# Altium schematic sheet frontscript.SchDoc
size A4
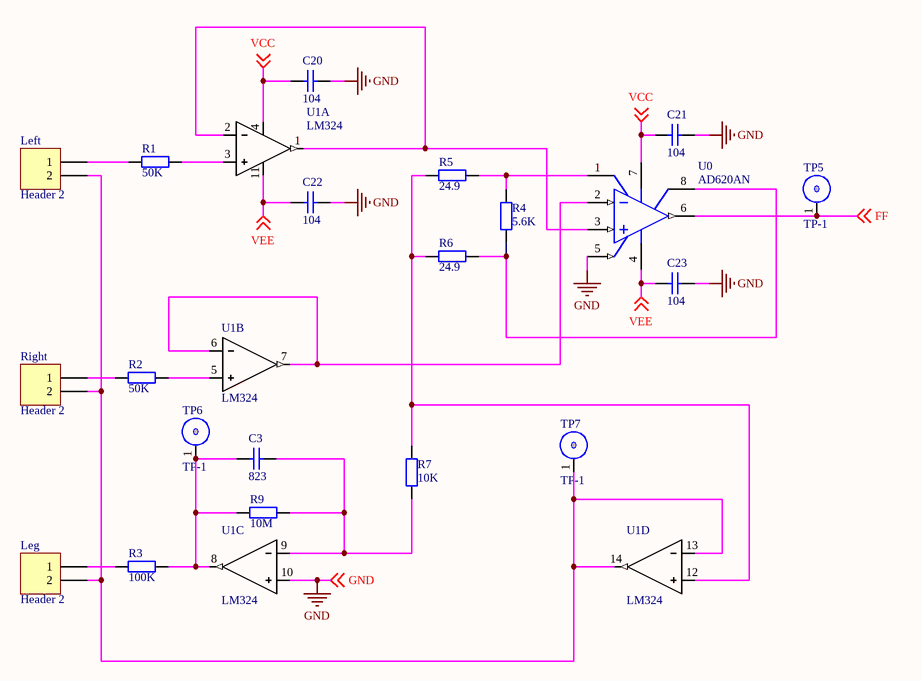
[diagram p0: frontscript.SchDoc]

## Parts
C3  823  [C2]
C20  104  [C2]
C21  104  [C2]
C22  104  [C2]
C23  104  [C2]
Left  Header 2  [SIP2L]
Leg  Header 2  [SIP2L]
R1  50K  [AXIAL-0.3]
R2  50K  [AXIAL-0.3]
R3  100K  [AXIAL-0.3]
R4  5.6K  [AXIAL-0.3]
R5  24.9  [AXIAL-0.3]
R6  24.9  [AXIAL-0.3]
R7  10K  [AXIAL-0.3]
R9  10M  [AXIAL-0.3]
Right  Header 2  [SIP2L]
TP5  TP-1  [tp-1-1]
TP6  TP-1  [tp-1-1]
TP7  TP-1  [tp-1-1]
U0  AD620AN  [DIP8]
U1  LM324  [DIP14]  (parts A,B,C,D of 4)

## Nets
GND: C20.2 C21.2 C22.2 C23.2 U0.5(REF) U1.10 ; off-sheet GND
FF: TP5.1 U0.6(OUT) ; off-sheet FF
VCC: C20.1 C21.1 U0.7(V+) U1.4 ; off-sheet VCC
VEE: C22.1 C23.1 U0.4(V-) U1.11 ; off-sheet VEE
NetC3_1: C3.1 R3.2 R9.1 TP6.1 U1.8
NetC3_2: C3.2 R7.1 R9.2 U1.9
NetLeft_1: Left.1 R1.1
NetLeft_2: Left.2 Leg.2 Right.2 TP7.1 U1.13 U1.14
NetLeg_1: Leg.1 R3.1
NetR1_2: R1.2 U1.3
NetR2_1: R2.1 Right.1
NetR2_2: R2.2 U1.5
NetR4_1: R4.1 R6.2 U0.8(RG)
NetR4_2: R4.2 R5.2 U0.1(RG)
NetR5_1: R5.1 R6.1 R7.2 U1.12
NetU0_2: U0.2(-IN) U1.6 U1.7
NetU0_3: U0.3(+IN) U1.1 U1.2

## Library data of the parts
C3 = Cap: Capacitor; Value: 82000pF; Published: 8-Jun-2000; LatestRevisionDate: 17-Jul-2002; LatestRevisionNote: Re-released for DXP Platform.; PackageReference: RAD-0.3; Publisher: Altium Limited; PackageDescription: Radial Cap, Thru-Hole; 2 Leads; 0.3 in Pin Spacing
C20-C23 = Cap: Capacitor; Value: 100000pF; Published: 8-Jun-2000; LatestRevisionDate: 17-Jul-2002; LatestRevisionNote: Re-released for DXP Platform.; PackageReference: RAD-0.3; Publisher: Altium Limited; PackageDescription: Radial Cap, Thru-Hole; 2 Leads; 0.3 in Pin Spacing
Left Leg Right = Header 2: Header, 2-Pin; LatestRevisionDate: 17-Jul-2002; LatestRevisionNote: Re-released for DXP Platform.; Publisher: Altium Limited
R1-R7 = Res2: Resistor; Published: 8-Jun-2000; LatestRevisionDate: 17-Jul-2002; LatestRevisionNote: Re-released for DXP Platform.; PackageReference: AXIAL-0.4; Publisher: Altium Limited; PackageDescription: Axial Device, Thru-Hole; 2 Leads; 0.4 in Pin Spacing
  R1 R2: Value: 50K
  R3: Value: 100K
  R4: Value: 5.6K
  R5 R6: Value: 24.9
  R7: Value: 10K
R9 = Res2: Resistor; Value: 10000K; Published: 8-Jun-2000; LatestRevisionDate: 17-Jul-2002; LatestRevisionNote: Re-released for DXP Platform.; PackageReference: AXIAL-0.4; Publisher: Altium Limited; PackageDescription: Axial Device, Thru-Hole; 2 Leads; 0.4 in Pin Spacing
U0 = AD620AN: Low-Cost, Low-Power Instrumentation Amplifier; Published: 8-Jun-2000; LatestRevisionDate: 04-Mar-2005; LatestRevisionNote: Stylized 3D Model Added.; DatasheetVersion: REV.D 1998; PackageVersion: revA; PackageReference: N-8; Publisher: Altium Limited; PackageDescription: DIP; 8 Leads; Row Spacing 7.62 mm; Pitch 2.54 mm; ComponentLink1Description: Manufacturer Link; ComponentLink1URL: http://www.analog.com/en/prod/0%2C2877%2CAD620%2C00.html; ComponentLink2Description: Datasheet; ComponentLink2URL: http://www.analog.com/UploadedFiles/Data_Sheets/897653854AD620_g.pdf